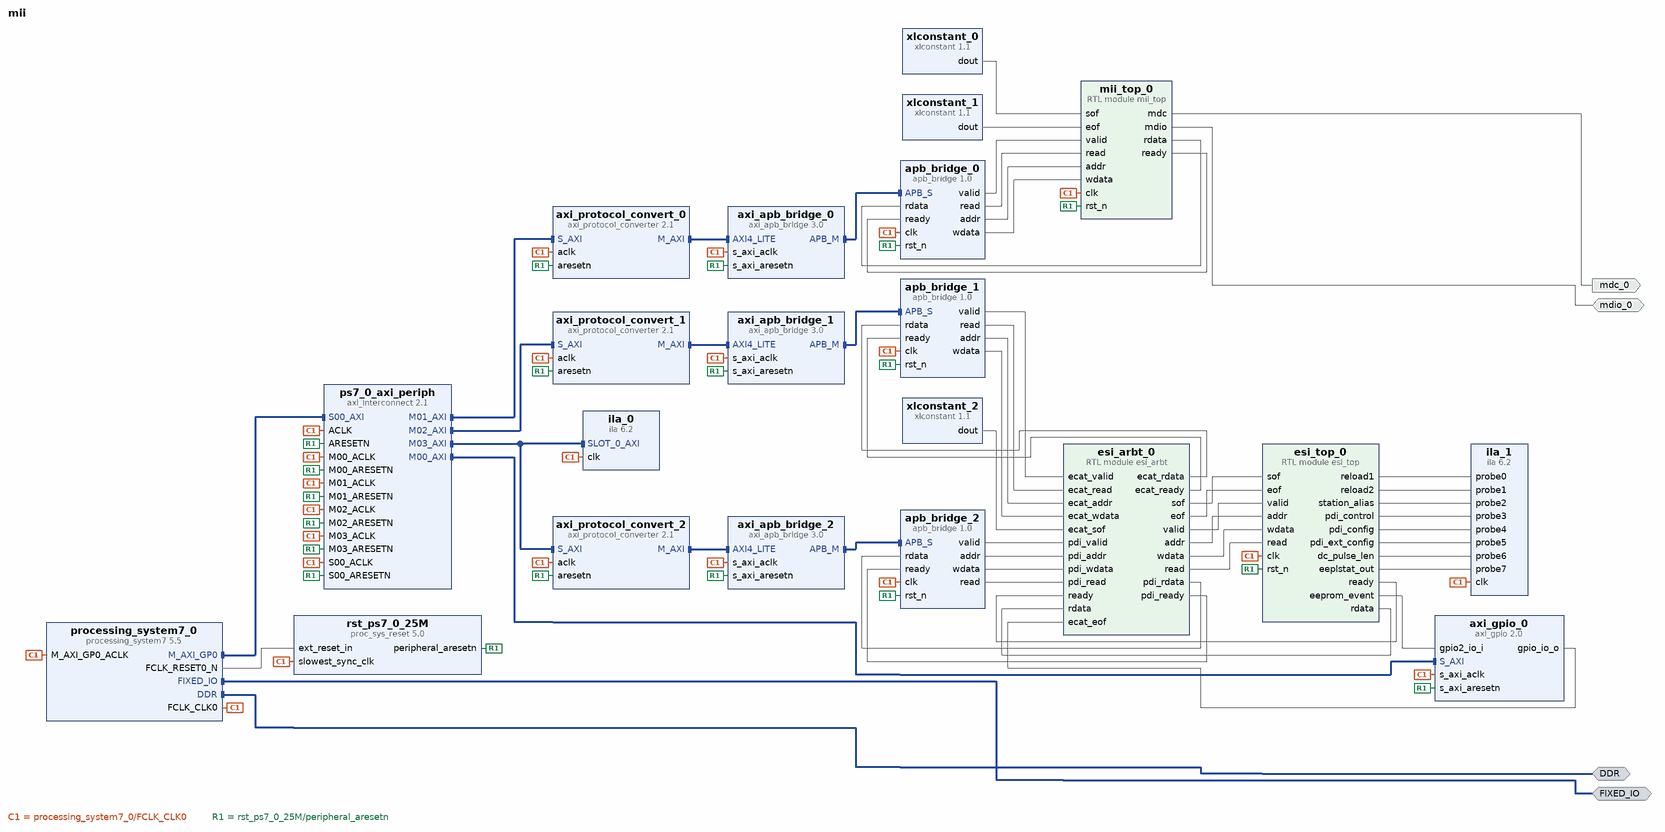
[diagram p0: block diagram of the top level]
# Vivado block design mii, xc7z020clg400-2, Vivado 2019.1
create_bd_design mii

create_bd_intf_port -mode Master -vlnv xilinx.com:interface:ddrx_rtl:1.0 DDR
create_bd_intf_port -mode Master -vlnv xilinx.com:display_processing_system7:fixedio_rtl:1.0 FIXED_IO
create_bd_port -dir O mdc_0
create_bd_port -dir IO mdio_0

create_bd_cell -type ip -vlnv xilinx.com:ip:processing_system7:5.5 processing_system7_0
set_property -dict [list \
  CONFIG.PCW_FPGA0_PERIPHERAL_FREQMHZ 25 \
  CONFIG.PCW_PRESET_BANK1_VOLTAGE {LVCMOS 1.8V} \
  CONFIG.PCW_UART1_PERIPHERAL_ENABLE 1 \
  CONFIG.PCW_UART1_UART1_IO {MIO 48 .. 49} \
  CONFIG.PCW_UART_PERIPHERAL_FREQMHZ 100 \
  CONFIG.PCW_UIPARAM_DDR_PARTNO {MT41K256M16 RE-125} \
] [get_bd_cells processing_system7_0]
# 44 more settings of processing_system7_0 are not shown: defaults, MIO pin electricals, DDR timing, and values the tool derives
create_bd_cell -type ip -vlnv xilinx.com:ip:axi_apb_bridge:3.0 axi_apb_bridge_0
set_property -dict {CONFIG.C_APB_NUM_SLAVES 1} [get_bd_cells axi_apb_bridge_0]
create_bd_cell -type ip -vlnv xilinx.com:ip:axi_gpio:2.0 axi_gpio_0
set_property -dict [list \
  CONFIG.C_ALL_INPUTS_2 1 \
  CONFIG.C_ALL_OUTPUTS 1 \
  CONFIG.C_GPIO2_WIDTH 1 \
  CONFIG.C_GPIO_WIDTH 1 \
  CONFIG.C_IS_DUAL 1 \
] [get_bd_cells axi_gpio_0]
create_bd_cell -type ip -vlnv xilinx.com:ip:xlconstant:1.1 xlconstant_0
set_property -dict {CONFIG.CONST_VAL 0} [get_bd_cells xlconstant_0]
create_bd_cell -type ip -vlnv xilinx.com:ip:axi_protocol_converter:2.1 axi_protocol_convert_0
create_bd_cell -type ip -vlnv xilinx.com:ip:axi_interconnect:2.1 ps7_0_axi_periph
set_property -dict {CONFIG.NUM_MI 4} [get_bd_cells ps7_0_axi_periph]
create_bd_cell -type ip -vlnv xilinx.com:ip:proc_sys_reset:5.0 rst_ps7_0_25M
create_bd_cell -type ip -vlnv xilinx.com:ip:axi_protocol_converter:2.1 axi_protocol_convert_1
create_bd_cell -type ip -vlnv xilinx.com:ip:axi_protocol_converter:2.1 axi_protocol_convert_2
create_bd_cell -type ip -vlnv xilinx.com:ip:axi_apb_bridge:3.0 axi_apb_bridge_1
set_property -dict {CONFIG.C_APB_NUM_SLAVES 1} [get_bd_cells axi_apb_bridge_1]
create_bd_cell -type ip -vlnv xilinx.com:ip:axi_apb_bridge:3.0 axi_apb_bridge_2
set_property -dict {CONFIG.C_APB_NUM_SLAVES 1} [get_bd_cells axi_apb_bridge_2]
create_bd_cell -type ip -vlnv xilinx.com:ip:ila:6.2 ila_1
set_property -dict [list \
  CONFIG.C_ENABLE_ILA_AXI_MON false \
  CONFIG.C_MONITOR_TYPE Native \
  CONFIG.C_NUM_OF_PROBES 8 \
  CONFIG.C_PROBE2_WIDTH 16 \
  CONFIG.C_PROBE3_WIDTH 16 \
  CONFIG.C_PROBE4_WIDTH 16 \
  CONFIG.C_PROBE5_WIDTH 16 \
  CONFIG.C_PROBE6_WIDTH 16 \
  CONFIG.C_PROBE7_WIDTH 1 \
] [get_bd_cells ila_1]
create_bd_cell -type ip -vlnv xilinx.com:ip:xlconstant:1.1 xlconstant_1
set_property -dict {CONFIG.CONST_VAL 0} [get_bd_cells xlconstant_1]
create_bd_cell -type ip -vlnv xilinx.com:ip:xlconstant:1.1 xlconstant_2
set_property -dict {CONFIG.CONST_VAL 0} [get_bd_cells xlconstant_2]
create_bd_cell -type module -reference esi_arbt esi_arbt_0
create_bd_cell -type ip -vlnv xilinx.com:ip:ila:6.2 ila_0
create_bd_cell -type module -reference esi_top esi_top_0
create_bd_cell -type module -reference mii_top mii_top_0
create_bd_cell -type ip -vlnv xilinx.com:user:apb_bridge:1.0 apb_bridge_0
create_bd_cell -type ip -vlnv xilinx.com:user:apb_bridge:1.0 apb_bridge_1
create_bd_cell -type ip -vlnv xilinx.com:user:apb_bridge:1.0 apb_bridge_2

# ---- connections ----

connect_bd_intf_net [get_bd_intf_ports FIXED_IO] [get_bd_intf_pins processing_system7_0/FIXED_IO]
connect_bd_intf_net [get_bd_intf_pins axi_protocol_convert_2/M_AXI] [get_bd_intf_pins axi_apb_bridge_2/AXI4_LITE]
connect_bd_intf_net [get_bd_intf_pins ps7_0_axi_periph/M00_AXI] [get_bd_intf_pins axi_gpio_0/S_AXI]
connect_bd_intf_net [get_bd_intf_pins axi_protocol_convert_1/M_AXI] [get_bd_intf_pins axi_apb_bridge_1/AXI4_LITE]
connect_bd_intf_net [get_bd_intf_pins ps7_0_axi_periph/M03_AXI] [get_bd_intf_pins axi_protocol_convert_2/S_AXI]
connect_bd_intf_net [get_bd_intf_pins ps7_0_axi_periph/M03_AXI] [get_bd_intf_pins ila_0/SLOT_0_AXI]
connect_bd_intf_net [get_bd_intf_ports DDR] [get_bd_intf_pins processing_system7_0/DDR]
connect_bd_intf_net [get_bd_intf_pins axi_protocol_convert_0/S_AXI] [get_bd_intf_pins ps7_0_axi_periph/M01_AXI]
connect_bd_intf_net [get_bd_intf_pins processing_system7_0/M_AXI_GP0] [get_bd_intf_pins ps7_0_axi_periph/S00_AXI]
connect_bd_intf_net [get_bd_intf_pins axi_protocol_convert_0/M_AXI] [get_bd_intf_pins axi_apb_bridge_0/AXI4_LITE]
connect_bd_intf_net [get_bd_intf_pins axi_apb_bridge_0/APB_M] [get_bd_intf_pins apb_bridge_0/APB_S]
connect_bd_intf_net [get_bd_intf_pins axi_apb_bridge_1/APB_M] [get_bd_intf_pins apb_bridge_1/APB_S]
connect_bd_intf_net [get_bd_intf_pins axi_apb_bridge_2/APB_M] [get_bd_intf_pins apb_bridge_2/APB_S]
connect_bd_intf_net [get_bd_intf_pins ps7_0_axi_periph/M02_AXI] [get_bd_intf_pins axi_protocol_convert_1/S_AXI]
connect_bd_net [get_bd_pins processing_system7_0/FCLK_CLK0] \
  [get_bd_pins processing_system7_0/M_AXI_GP0_ACLK] [get_bd_pins ps7_0_axi_periph/S00_ACLK] \
  [get_bd_pins rst_ps7_0_25M/slowest_sync_clk] [get_bd_pins axi_gpio_0/s_axi_aclk] [get_bd_pins ps7_0_axi_periph/M00_ACLK] \
  [get_bd_pins ps7_0_axi_periph/ACLK] [get_bd_pins axi_apb_bridge_0/s_axi_aclk] [get_bd_pins axi_protocol_convert_0/aclk] \
  [get_bd_pins ps7_0_axi_periph/M01_ACLK] [get_bd_pins axi_protocol_convert_1/aclk] [get_bd_pins axi_protocol_convert_2/aclk] \
  [get_bd_pins axi_apb_bridge_1/s_axi_aclk] [get_bd_pins axi_apb_bridge_2/s_axi_aclk] [get_bd_pins ila_1/clk] \
  [get_bd_pins ps7_0_axi_periph/M02_ACLK] [get_bd_pins ps7_0_axi_periph/M03_ACLK] [get_bd_pins ila_0/clk] \
  [get_bd_pins esi_top_0/clk] [get_bd_pins mii_top_0/clk] [get_bd_pins apb_bridge_0/clk] [get_bd_pins apb_bridge_1/clk] \
  [get_bd_pins apb_bridge_2/clk]
connect_bd_net [get_bd_pins xlconstant_0/dout] [get_bd_pins mii_top_0/sof]
connect_bd_net [get_bd_pins mii_top_0/mdc] [get_bd_ports mdc_0]
connect_bd_net [get_bd_ports mdio_0] [get_bd_pins mii_top_0/mdio]
connect_bd_net [get_bd_pins processing_system7_0/FCLK_RESET0_N] [get_bd_pins rst_ps7_0_25M/ext_reset_in]
connect_bd_net [get_bd_pins rst_ps7_0_25M/peripheral_aresetn] \
  [get_bd_pins ps7_0_axi_periph/S00_ARESETN] [get_bd_pins axi_gpio_0/s_axi_aresetn] \
  [get_bd_pins ps7_0_axi_periph/M00_ARESETN] [get_bd_pins ps7_0_axi_periph/ARESETN] \
  [get_bd_pins axi_apb_bridge_0/s_axi_aresetn] [get_bd_pins axi_protocol_convert_0/aresetn] \
  [get_bd_pins ps7_0_axi_periph/M01_ARESETN] [get_bd_pins axi_protocol_convert_1/aresetn] \
  [get_bd_pins axi_protocol_convert_2/aresetn] [get_bd_pins axi_apb_bridge_1/s_axi_aresetn] \
  [get_bd_pins axi_apb_bridge_2/s_axi_aresetn] [get_bd_pins ps7_0_axi_periph/M02_ARESETN] \
  [get_bd_pins ps7_0_axi_periph/M03_ARESETN] [get_bd_pins esi_top_0/rst_n] [get_bd_pins mii_top_0/rst_n] \
  [get_bd_pins apb_bridge_0/rst_n] [get_bd_pins apb_bridge_1/rst_n] [get_bd_pins apb_bridge_2/rst_n]
connect_bd_net [get_bd_pins apb_bridge_0/valid] [get_bd_pins mii_top_0/valid]
connect_bd_net [get_bd_pins apb_bridge_0/read] [get_bd_pins mii_top_0/read]
connect_bd_net [get_bd_pins apb_bridge_0/addr] [get_bd_pins mii_top_0/addr]
connect_bd_net [get_bd_pins apb_bridge_0/wdata] [get_bd_pins mii_top_0/wdata]
connect_bd_net [get_bd_pins mii_top_0/rdata] [get_bd_pins apb_bridge_0/rdata]
connect_bd_net [get_bd_pins mii_top_0/ready] [get_bd_pins apb_bridge_0/ready]
connect_bd_net [get_bd_pins esi_arbt_0/sof] [get_bd_pins esi_top_0/sof]
connect_bd_net [get_bd_pins esi_arbt_0/eof] [get_bd_pins esi_top_0/eof]
connect_bd_net [get_bd_pins esi_arbt_0/valid] [get_bd_pins esi_top_0/valid]
connect_bd_net [get_bd_pins esi_arbt_0/addr] [get_bd_pins esi_top_0/addr]
connect_bd_net [get_bd_pins esi_arbt_0/wdata] [get_bd_pins esi_top_0/wdata]
connect_bd_net [get_bd_pins esi_arbt_0/read] [get_bd_pins esi_top_0/read]
connect_bd_net [get_bd_pins apb_bridge_1/valid] [get_bd_pins esi_arbt_0/ecat_valid]
connect_bd_net [get_bd_pins apb_bridge_1/read] [get_bd_pins esi_arbt_0/ecat_read]
connect_bd_net [get_bd_pins esi_arbt_0/ecat_rdata] [get_bd_pins apb_bridge_1/rdata]
connect_bd_net [get_bd_pins esi_arbt_0/ecat_ready] [get_bd_pins apb_bridge_1/ready]
connect_bd_net [get_bd_pins apb_bridge_1/addr] [get_bd_pins esi_arbt_0/ecat_addr]
connect_bd_net [get_bd_pins apb_bridge_1/wdata] [get_bd_pins esi_arbt_0/ecat_wdata]
connect_bd_net [get_bd_pins apb_bridge_2/valid] [get_bd_pins esi_arbt_0/pdi_valid]
connect_bd_net [get_bd_pins apb_bridge_2/addr] [get_bd_pins esi_arbt_0/pdi_addr]
connect_bd_net [get_bd_pins apb_bridge_2/wdata] [get_bd_pins esi_arbt_0/pdi_wdata]
connect_bd_net [get_bd_pins esi_arbt_0/pdi_rdata] [get_bd_pins apb_bridge_2/rdata]
connect_bd_net [get_bd_pins esi_arbt_0/pdi_ready] [get_bd_pins apb_bridge_2/ready]
connect_bd_net [get_bd_pins apb_bridge_2/read] [get_bd_pins esi_arbt_0/pdi_read]
connect_bd_net [get_bd_pins esi_top_0/ready] [get_bd_pins esi_arbt_0/ready]
connect_bd_net [get_bd_pins esi_top_0/rdata] [get_bd_pins esi_arbt_0/rdata]
connect_bd_net [get_bd_pins xlconstant_1/dout] [get_bd_pins mii_top_0/eof]
connect_bd_net [get_bd_pins xlconstant_2/dout] [get_bd_pins esi_arbt_0/ecat_sof]
connect_bd_net [get_bd_pins axi_gpio_0/gpio_io_o] [get_bd_pins esi_arbt_0/ecat_eof]
connect_bd_net [get_bd_pins esi_top_0/eeprom_event] [get_bd_pins axi_gpio_0/gpio2_io_i]
connect_bd_net [get_bd_pins esi_top_0/reload1] [get_bd_pins ila_1/probe0]
connect_bd_net [get_bd_pins esi_top_0/reload2] [get_bd_pins ila_1/probe1]
connect_bd_net [get_bd_pins esi_top_0/station_alias] [get_bd_pins ila_1/probe2]
connect_bd_net [get_bd_pins esi_top_0/pdi_control] [get_bd_pins ila_1/probe3]
connect_bd_net [get_bd_pins esi_top_0/pdi_config] [get_bd_pins ila_1/probe4]
connect_bd_net [get_bd_pins esi_top_0/pdi_ext_config] [get_bd_pins ila_1/probe5]
connect_bd_net [get_bd_pins esi_top_0/dc_pulse_len] [get_bd_pins ila_1/probe6]
connect_bd_net [get_bd_pins esi_top_0/eeplstat_out] [get_bd_pins ila_1/probe7]

# ---- address map ----
assign_bd_address -offset 0x41200000 -range 64K -target_address_space [get_bd_addr_spaces processing_system7_0/Data] [get_bd_addr_segs axi_gpio_0/S_AXI/Reg]
assign_bd_address -offset 0x43C00000 -range 64K -target_address_space [get_bd_addr_spaces processing_system7_0/Data] [get_bd_addr_segs apb_bridge_0/APB_S/Reg]
assign_bd_address -offset 0x43C10000 -range 64K -target_address_space [get_bd_addr_spaces processing_system7_0/Data] [get_bd_addr_segs apb_bridge_1/APB_S/Reg]
assign_bd_address -offset 0x43C20000 -range 64K -target_address_space [get_bd_addr_spaces processing_system7_0/Data] [get_bd_addr_segs apb_bridge_2/APB_S/Reg]

validate_bd_design
save_bd_design
